# Altium schematic sheet USB Host.SchDoc
size 297 x 209 mm
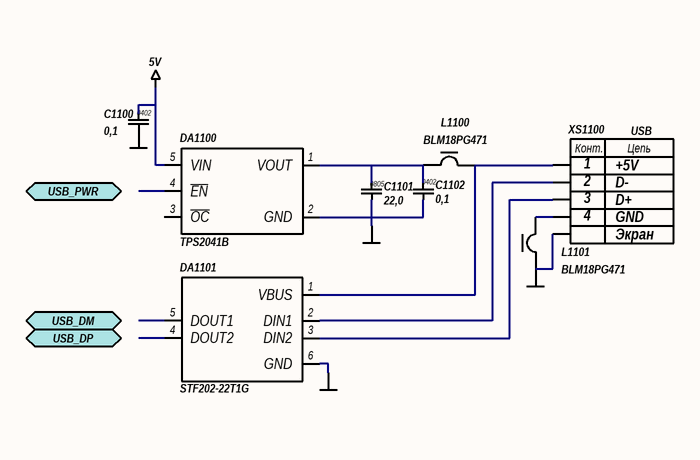
[diagram p0: USB Host.SchDoc]

## Parts
C1100  0,1  [CAP0402]
C1101  22,0  [CAP0805]
C1102  0,1  [CAP0402]
DA1100  TPS2041B  [SOT23-5]
DA1101  STF202-22T1G  [SOT23-6]
L1100  BLM18PG471  [FB0603]
L1101  BLM18PG471  [FB0603]
XS1100  USB  [USB-A 1J]

## Ports
USB_DM (bidir), USB_DP (bidir), USB_PWR (in)

## Nets
5V: C1100.1 DA1100.5(VIN)
GND: C1100.2 C1101.2 C1102.2 DA1100.2(GND) DA1101.6(GND) L1101.1 XS1100.0(Экран)
NetC1101_1: C1101.1 C1102.1 DA1100.1(VOUT) L1100.1
NetDA1101_1: DA1101.1(VBUS) L1100.2 XS1100.1(+5V)
NetDA1101_2: DA1101.2(DIN1) XS1100.2(D-)
NetDA1101_3: DA1101.3(DIN2) XS1100.3(D+)
NetL1101_2: L1101.2 XS1100.4(GND)

Not connected (* = marked no-connect by the designer): DA1100 3(~{OC}) 4(~{EN}); DA1101 4(DOUT2) 5(DOUT1)

## Notes on the sheet
- (in symbol USB 1J) Конт.; Цепь

## Library data of the parts
C1100 C1102 = CAP_0402: Конденсатор чип; Тип корпуса: 0402; Тип монтажа: Поверхностный; Номинал: 0,1; Тип компонента: Конденсатор чип; Value: 0,1
C1101 = CAP_0805: Конденсатор чип; Тип корпуса: 0805; Тип монтажа: Поверхностный; Номинал: 22,0; Тип компонента: Конденсатор чип; Value: 22,0
DA1100 = TPS2041B: Интерфейс USB контроллер питания; Производитель: Texas Instruments; Тип монтажа: Поверхностный; Наименование: TPS2041B; Тип компонента: Интерфейс USB контроллер питания; Тип корпуса: SOT23-5
DA1101 = STF202-22T1G: Интерфейс USB защита+фильтр; Производитель: ON Semiconductor; Тип монтажа: Поверхностный; Наименование: STF202-22T1G; Тип компонента: Интерфейс USB защита+фильтр; Тип корпуса: SOT23-6
L1100 L1101 = BLM18PG: Ферритовая бусина; Производитель: Murata; Тип корпуса: 0603; Тип монтажа: Поверхностный; Наименование: BLM18PG471; Тип компонента: Ферритовая бусина
XS1100 = USB 1J: Разъем USB; Тип монтажа: Штыревой; Тип компонента: Разъем USB